# EAGLE schematic T06_preliminarySchematic_v1 (EAGLE 7.3.0)
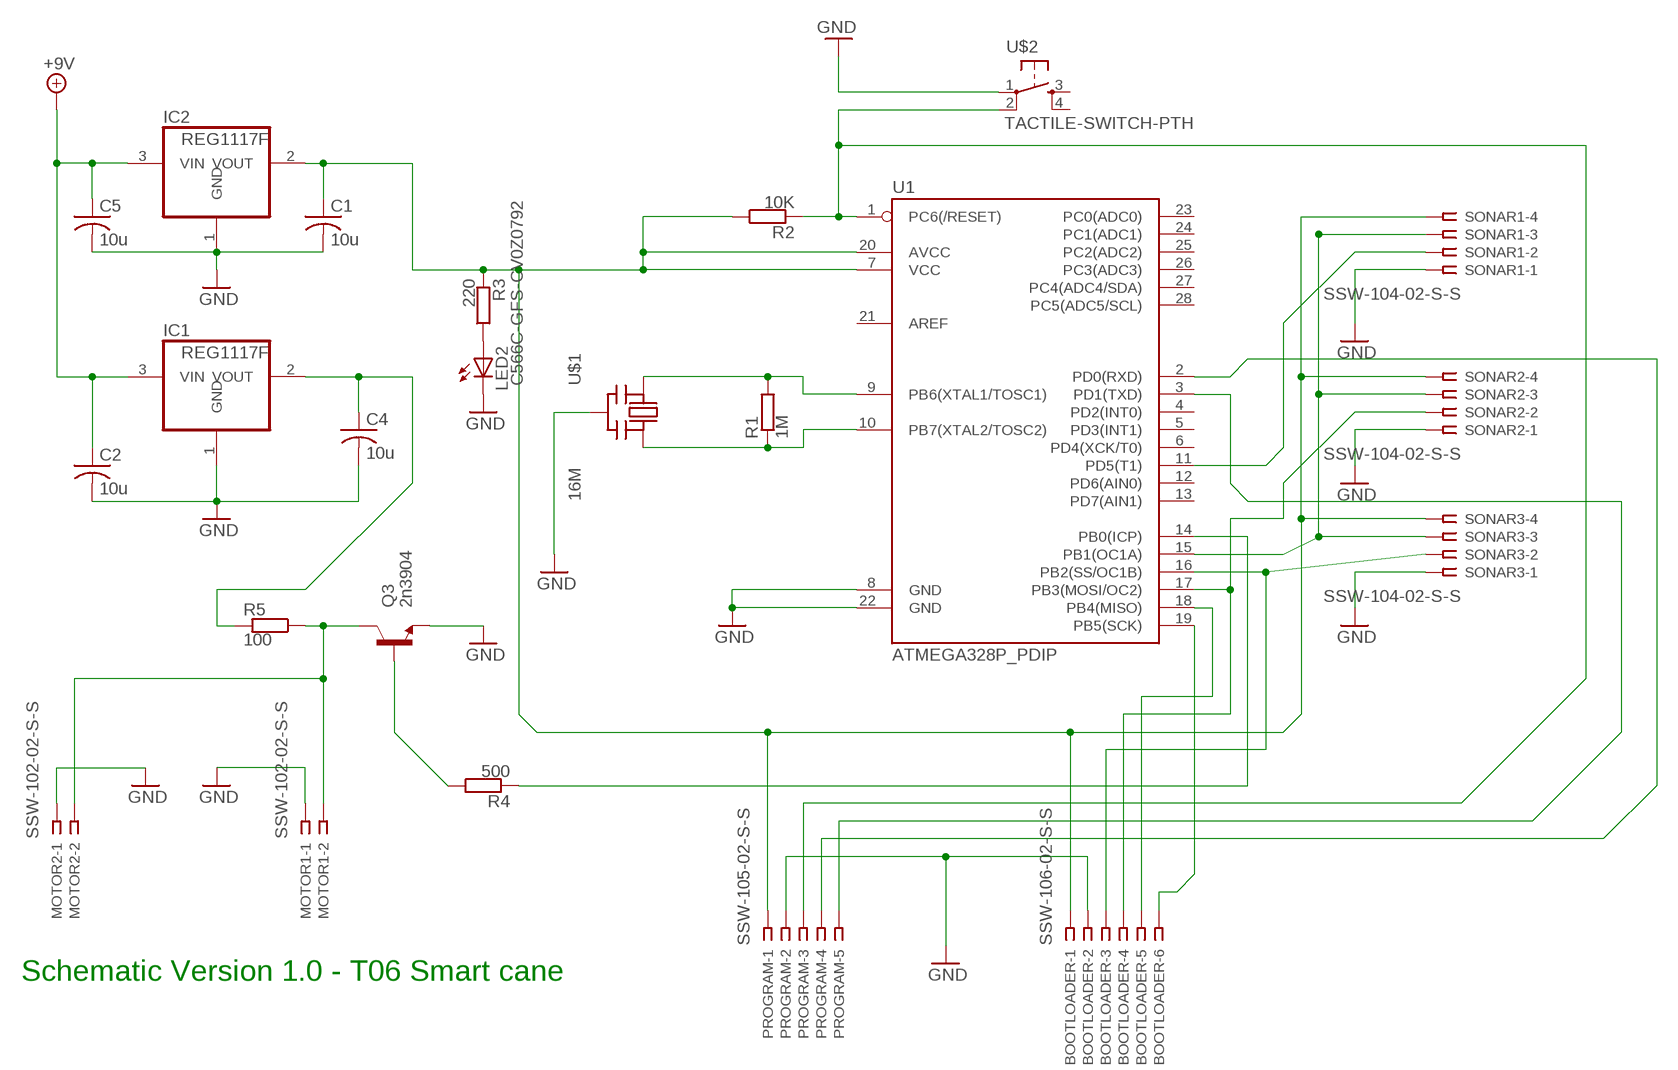
[diagram p0: schematic, sheet 1]

## Parts
BOOTLOADER  SSW-106-02-S-S  [SSW-106-02-S-S]
C1  10u  C-USC0805K  [C0805K]
C2  10u  C-USC0805K  [C0805K]
C4  10u  C-USC0805K  [C0805K]
C5  10u  C-USC0805K  [C0805K]
IC1  REG1117F  [DD-3]
IC2  REG1117F  [DD-3]
LED2  C566C-GFS-CV0Z0792  LEDCHIPLED_1206  [CHIPLED_1206]
MOTOR1  SSW-102-02-S-S  [SSW-102-02-S-S]
MOTOR2  SSW-102-02-S-S  [SSW-102-02-S-S]
PROGRAM  SSW-105-02-S-S  [SSW-105-02-S-S]
Q3  2n3904  TRANSISTOR_NPNTO-92-AMMO  [TO-92-AMMO]
R1  1M  SMR-0  [SMR-0]
R2  10K  SMR-0  [SMR-0]
R3  220  SMR-0  [SMR-0]
R4  500  SMR-0  [SMR-0]
R5  100  SMR-0  [SMR-0]
SONAR1  SSW-104-02-S-S  [SSW-104-02-S-S]
SONAR2  SSW-104-02-S-S  [SSW-104-02-S-S]
SONAR3  SSW-104-02-S-S  [SSW-104-02-S-S]
U1  ATMEGA328P_PDIP  [DIL28-3]
U$1  16M  CERMOSCILL-THM  [CERM_OSC]
U$2  TACTILE-SWITCH-PTH  [TAC-SWITCH-PTH]

## Nets
+9V: C2.1 C5.1 IC1.3(VIN) IC2.3(VIN)
GND: BOOTLOADER.2 C1.2 C2.2 C4.2 C5.2 IC1.1(GND) IC2.1(GND) LED2.C MOTOR1.1 MOTOR2.1 PROGRAM.2 Q3.1(E) SONAR1.1 SONAR2.1 SONAR3.1 U1.8(GND) U1.22(GND) U$1.P$2(GND) U$2.1
N$1: R1.2 U1.10(PB7(XTAL2/TOSC2)) U$1.P$3(OUT)
N$2: R1.1 U1.9(PB6(XTAL1/TOSC1)) U$1.P$1(IN)
N$3: PROGRAM.4 U1.2(PD0(RXD))
N$4: PROGRAM.3 R2.2 U1.1(PC6(/RESET)) U$2.2
N$6: PROGRAM.5 U1.3(PD1(TXD))
N$7: C4.1 IC1.2(VOUT) R5.2
N$8: LED2.A R3.1
N$9: R4.2 U1.14(PB0(ICP))
N$10: Q3.2(B) R4.1
N$11: MOTOR1.2 MOTOR2.2 Q3.3(C) R5.1
N$12: BOOTLOADER.6 U1.19(PB5(SCK))
N$13: BOOTLOADER.5 U1.18(PB4(MISO))
N$14: BOOTLOADER.3 SONAR3.2 U1.16(PB2(SS/OC1B))
N$15: BOOTLOADER.1 C1.1 IC2.2(VOUT) PROGRAM.1 R2.1 R3.2 SONAR1.4 SONAR2.4 SONAR3.4 U1.7(VCC) U1.20(AVCC)
N$17: SONAR1.3 SONAR2.3 SONAR3.3 U1.15(PB1(OC1A))
N$18: BOOTLOADER.4 SONAR2.2 U1.17(PB3(MOSI/OC2))
N$19: SONAR1.2 U1.11(PD5(T1))
Unconnected: U1.4(PD2(INT0)) U1.5(PD3(INT1)) U1.6(PD4(XCK/T0)) U1.12(PD6(AIN0)) U1.13(PD7(AIN1)) U1.21(AREF) U1.23(PC0(ADC0)) U1.24(PC1(ADC1)) U1.25(PC2(ADC2)) U1.26(PC3(ADC3)) U1.27(PC4(ADC4/SDA)) U1.28(PC5(ADC5/SCL)) U$2.3 U$2.4

## Notes on the sheet
- Schematic Version 1.0 - T06 Smart cane

## Library data of the parts
BOOTLOADER = con-samtec:SSW-106-02-S-S: THROUGH-HOLE .025" SQ POST SOCKET Source: Samtec SSW.pdf; MPN: SSW-106-02-S-S; OC_FARNELL: unknown; OC_NEWARK: 11P9416
C1 C2 C4 C5 = adafruit:C-US: CAPACITOR, American symbol
IC1 IC2 = burr-brown:REG1117: 800mA and 1A Low Dropout (LDO) Positive Regulator 1.8V, 2.5V, 2.85V, 3.3V, 5V, and Adj; MF: TEXAS INSTRUMENTS; MPN: REG1117FAKTTT; OC_FARNELL: 1296120; OC_NEWARK: 87H2562
LED2 = adafruit:LED: LED OSRAM: - CHIPLED LG R971, LG N971, LY N971, LG Q971, LY Q971, LO R971, LY R971 LH N974, LH R974 LS Q976, LO Q976, LY Q976 LO Q996 - Hyper CHIPLED LW Q18S LB Q993, LB Q99A, LB R99A - SideLED LS A670, LO A670, LY A670, LG A670, LP A670 LB A673, LV A673, LT A673, LW A673 LH A674 LY A675 LS A676, LA A676, LO A676, LY A676, LW A676 LS A679, LY A679, LG A679 - Hyper Micro SIDELED® LS Y876, LA Y876, LO Y876, LY Y876 LT Y87S - SmartLED LW L88C, LW L88S LB L89C, LB L89S, LG L890 LS L89K, LO L89K, LY L89K LS L896, LA L896, LO L896, LY L896 - TOPLED LS T670, LO T670, LY T670, LG T670, LP T670 LSG T670, LSP T670, LSY T670, LOP T670, LYG T670 LG T671, LOG T671, LSG T671 LB T673, LV T673, LT T673, LW T673 LH T674 LS T676, LA T676, LO T676, LY T676, LB T676, LH T676, LSB T676, LW T676 LB T67C, LV T67C, LT T67C, LS T67K, LO T67K, LY T67K, LW E67C LS E67B, LA E67B, LO E67B, LY E67B, LB E67C, LV E67C, LT E67C LW T67C LS T679, LY T679, LG T679 LS T770, LO T770, LY T770, LG T770, LP T770 LB T773, LV T773, LT T773, LW T773 LH T774 LS E675, LA E675, LY E675, LS T675 LS T776, LA T776, LO T776, LY T776, LB T776 LHGB T686 LT T68C, LB T68C - Hyper Mini TOPLED® LB M676 - Mini TOPLED Santana® LG M470 LS M47K, LO M47K, LY M47K Source: http://www.osram.convergy.de/
MOTOR1 MOTOR2 = con-samtec:SSW-102-02-S-S: THROUGH-HOLE .025" SQ POST SOCKET Source: Samtec SSW.pdf; MPN: SSW-102-02-S-S; OC_FARNELL: unknown; OC_NEWARK: 11P9351
PROGRAM = con-samtec:SSW-105-02-S-S: THROUGH-HOLE .025" SQ POST SOCKET Source: Samtec SSW.pdf; MPN: SSW-105-02-S-S; OC_FARNELL: unknown; OC_NEWARK: 11P9399
Q3 = SparkFun-DiscreteSemi:TRANSISTOR_NPN: Generic NPN BJT MMBT2222A - TRANS-08049 (SOT-23, 1A 40V) MPSA42 - TRANS-09116 (SOT-23, 500mA 300V) MMBT5088LT1G - TRANS-11160 (SOT-23, 50 mA 30V) BC547 - COM-08928 <http://www.sparkfun.com/products/8928> (TO-92 45V 100mA) (1.Collector 2.Base 3.Emitter) 2N3904 - COM-00521 <http://www.sparkfun.com/products/521> (TO-92 40V 200mA) (1.Emitter 2.Base 3.Collector) P2N2222A - COM-12852 <http://www.sparkfun.com/products/12852> (TO-92 40V 600mA) (1.Collector 2.Base 3.Emitter)
R1-R5 = resistor-shunt:SMR-0: SMD SHUNT RESISTOR; OC_FARNELL: unknown; OC_NEWARK: unknown
SONAR1-SONAR3 = con-samtec:SSW-104-02-S-S: THROUGH-HOLE .025" SQ POST SOCKET Source: Samtec SSW.pdf; MPN: SSW-104-02-S-S; OC_FARNELL: unknown; OC_NEWARK: 11P9384
U1 = SparkFun-DigitalIC:ATMEGA328P_PDIP: uC used in the Arduino 32kb flash, 1k EEPROM, 2k SRAM This is the through-hole version of this chip.
U$1 = adafruit:CERMOSCILL: Ceramic oscillator with built in capacitors such as ZTT-12MHz http://www.ladyada.net/library/eagle
U$2 = GeekAmmo:TACTILE-SWITCH: Tactile Switch 4 Pins, SPST NO